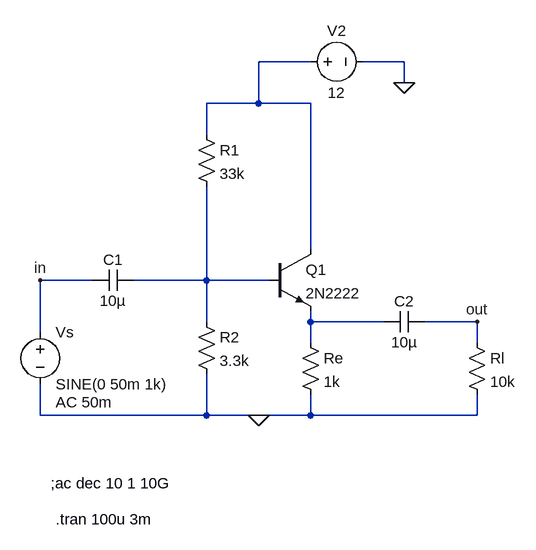
[diagram p0: schematic Voltage Series Feedback amplifier.asc]
Voltage Series Feedback amplifier.asc, the LTspice schematic file:
Version 4
SHEET 1 880 680
WIRE 304 -192 224 -192
WIRE 448 -192 384 -192
WIRE 448 -160 448 -192
WIRE 224 -128 224 -192
WIRE 224 -128 144 -128
WIRE 304 -128 224 -128
WIRE 144 -80 144 -128
WIRE 304 96 304 -128
WIRE -32 144 -112 144
WIRE 144 144 144 0
WIRE 144 144 32 144
WIRE 240 144 144 144
WIRE 144 208 144 144
WIRE 304 208 304 192
WIRE 416 208 304 208
WIRE 560 208 480 208
WIRE -112 224 -112 144
WIRE 304 240 304 208
WIRE 560 240 560 208
WIRE -112 352 -112 304
WIRE 144 352 144 288
WIRE 144 352 -112 352
WIRE 224 352 144 352
WIRE 304 352 304 320
WIRE 304 352 224 352
WIRE 560 352 560 320
WIRE 560 352 304 352
FLAG 448 -160 0
FLAG 224 352 0
FLAG -112 144 in
FLAG 560 208 out
SYMBOL voltage -112 208 R0
WINDOW 123 24 124 Left 2
WINDOW 39 0 0 Left 0
SYMATTR InstName Vs
SYMATTR Value SINE(0 50m 1k)
SYMATTR Value2 AC 50m
SYMBOL cap 32 128 R90
WINDOW 0 0 32 VBottom 2
WINDOW 3 32 32 VTop 2
SYMATTR InstName C1
SYMATTR Value 10µ
SYMBOL res 128 192 R0
SYMATTR InstName R2
SYMATTR Value 3.3k
SYMBOL res 128 -96 R0
SYMATTR InstName R1
SYMATTR Value 33k
SYMBOL res 288 224 R0
SYMATTR InstName Re
SYMATTR Value 1k
SYMBOL npn 240 96 R0
SYMATTR InstName Q1
SYMATTR Value 2N2222
SYMBOL cap 480 192 R90
WINDOW 0 0 32 VBottom 2
WINDOW 3 32 32 VTop 2
SYMATTR InstName C2
SYMATTR Value 10µ
SYMBOL res 544 224 R0
SYMATTR InstName Rl
SYMATTR Value 10k
SYMBOL voltage 288 -192 R270
WINDOW 0 32 56 VTop 2
WINDOW 3 -32 56 VBottom 2
WINDOW 123 0 0 Left 0
WINDOW 39 0 0 Left 0
SYMATTR InstName V2
SYMATTR Value 12
TEXT -96 456 Left 2 !;ac dec 10 1 10G
TEXT -88 512 Left 2 !.tran 100u 3m

The netlist it stands for:
* Voltage Series Feedback amplifier.asc
Vs in 0 SINE(0 50m 1k) AC 50m
C1 N002 in 10µ
R2 N002 0 3.3k
R1 N001 N002 33k
Re N003 0 1k
Q1 N001 N002 N003 0 2N2222
C2 out N003 10µ
Rl out 0 10k
V2 N001 0 12
.model NPN NPN
.model PNP PNP
.lib standard.bjt
;ac dec 10 1 10G
.tran 100u 3m
.backanno
.end